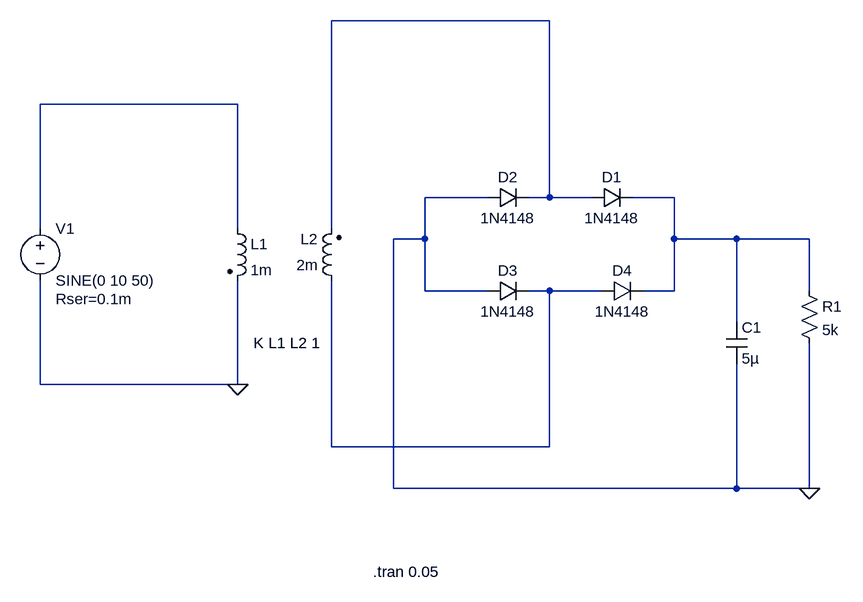
[diagram p0: schematic Full Wave.asc]
Full Wave.asc, the LTspice schematic file:
Version 4
SHEET 1 880 680
WIRE 80 -336 -256 -336
WIRE -400 -208 -704 -208
WIRE -16 -64 -112 -64
WIRE 80 -64 80 -336
WIRE 80 -64 48 -64
WIRE 144 -64 80 -64
WIRE 272 -64 208 -64
WIRE -704 -16 -704 -208
WIRE -400 -16 -400 -208
WIRE -256 -16 -256 -336
WIRE -112 0 -112 -64
WIRE -112 0 -160 0
WIRE 272 0 272 -64
WIRE 368 0 272 0
WIRE 480 0 368 0
WIRE -112 80 -112 0
WIRE -16 80 -112 80
WIRE 80 80 48 80
WIRE 160 80 80 80
WIRE 272 80 272 0
WIRE 272 80 224 80
WIRE 480 80 480 0
WIRE 368 128 368 0
WIRE -704 224 -704 64
WIRE -400 224 -400 64
WIRE -400 224 -704 224
WIRE -256 320 -256 64
WIRE 80 320 80 80
WIRE 80 320 -256 320
WIRE -160 384 -160 0
WIRE 368 384 368 192
WIRE 368 384 -160 384
WIRE 480 384 480 160
WIRE 480 384 368 384
FLAG -400 224 0
FLAG 480 384 0
SYMBOL diode 144 -48 R270
WINDOW 0 32 32 VTop 2
WINDOW 3 0 32 VBottom 2
SYMATTR InstName D1
SYMATTR Value 1N4148
SYMBOL diode -16 -48 R270
WINDOW 0 32 32 VTop 2
WINDOW 3 0 32 VBottom 2
SYMATTR InstName D2
SYMATTR Value 1N4148
SYMBOL diode -16 96 R270
WINDOW 0 32 32 VTop 2
WINDOW 3 0 32 VBottom 2
SYMATTR InstName D3
SYMATTR Value 1N4148
SYMBOL diode 160 96 R270
WINDOW 0 32 32 VTop 2
WINDOW 3 0 32 VBottom 2
SYMATTR InstName D4
SYMATTR Value 1N4148
SYMBOL ind2 -416 -32 R0
SYMATTR InstName L1
SYMATTR Value 1m
SYMATTR Type ind
SYMBOL ind2 -240 80 R180
WINDOW 0 36 80 Left 2
WINDOW 3 36 40 Left 2
SYMATTR InstName L2
SYMATTR Value 2m
SYMATTR Type ind
SYMBOL res 464 64 R0
SYMATTR InstName R1
SYMATTR Value 5k
SYMBOL voltage -704 -32 R0
WINDOW 123 0 0 Left 0
WINDOW 39 24 124 Left 2
SYMATTR InstName V1
SYMATTR Value SINE(0 10 50)
SYMATTR SpiceLine Rser=0.1m
SYMBOL cap 352 128 R0
SYMATTR InstName C1
SYMATTR Value 5µ
TEXT -376 160 Left 2 !K L1 L2 1
TEXT -192 512 Left 2 !.tran 0.05

The netlist it stands for:
* Full Wave.asc
D1 N001 N003 1N4148
D2 0 N001 1N4148
D3 0 N004 1N4148
D4 N004 N003 1N4148
L1 N002 0 1m
L2 N004 N001 2m
R1 N003 0 5k
V1 N002 0 SINE(0 10 50) Rser=0.1m
C1 N003 0 5µ
.model D D
.lib standard.dio
K L1 L2 1
.tran 0.05
.backanno
.end